# EAGLE design LT ABID SCR (EAGLE 9.6.2)
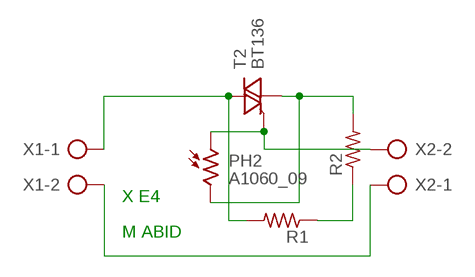
[diagram p0: schematic, sheet 1]

## Parts
PH2  A1060_09  [T0-46-A10XX]
R1  R-US_0204/7  [0204/7]
R2  R-US_0204/7  [0204/7]
T2  BT136  [TO220AB]
X1  AK300/2  [AK300/2]
X2  AK300/2  [AK300/2]

## Nets
N$1: PH2.2 R2.2 T2.1(A1)
N$3: R1.1 R2.1
N$4: PH2.1 T2.3(G) X2.2
N$5: R1.2 T2.2(A2) X1.1
N$7: X1.2 X2.1

## Notes on the sheet
- X E4
- M ABID

## Library data of the parts
PH2 = ldr:A10: Sensor Robust Light Sensing Applications Outdoor Light Sensing Application Source: http://optoelectronics.perkinelmer.com/content/Datasheets/DTS_PhotocellsA1050.pdf
R1 R2 = R1:R-US_: RESISTOR, American symbol; SPICEPREFIX: R
T2 = triac:BT136: Triac BT136 series E sensitive gate Source: http://www.nxp.com/acrobat_download/datasheets/BT136_SERIES_E_2.pdf
X1 X2 = con-ptr500:AK300/2: CONNECTOR; OC_FARNELL: unknown; OC_NEWARK: unknown

## Board
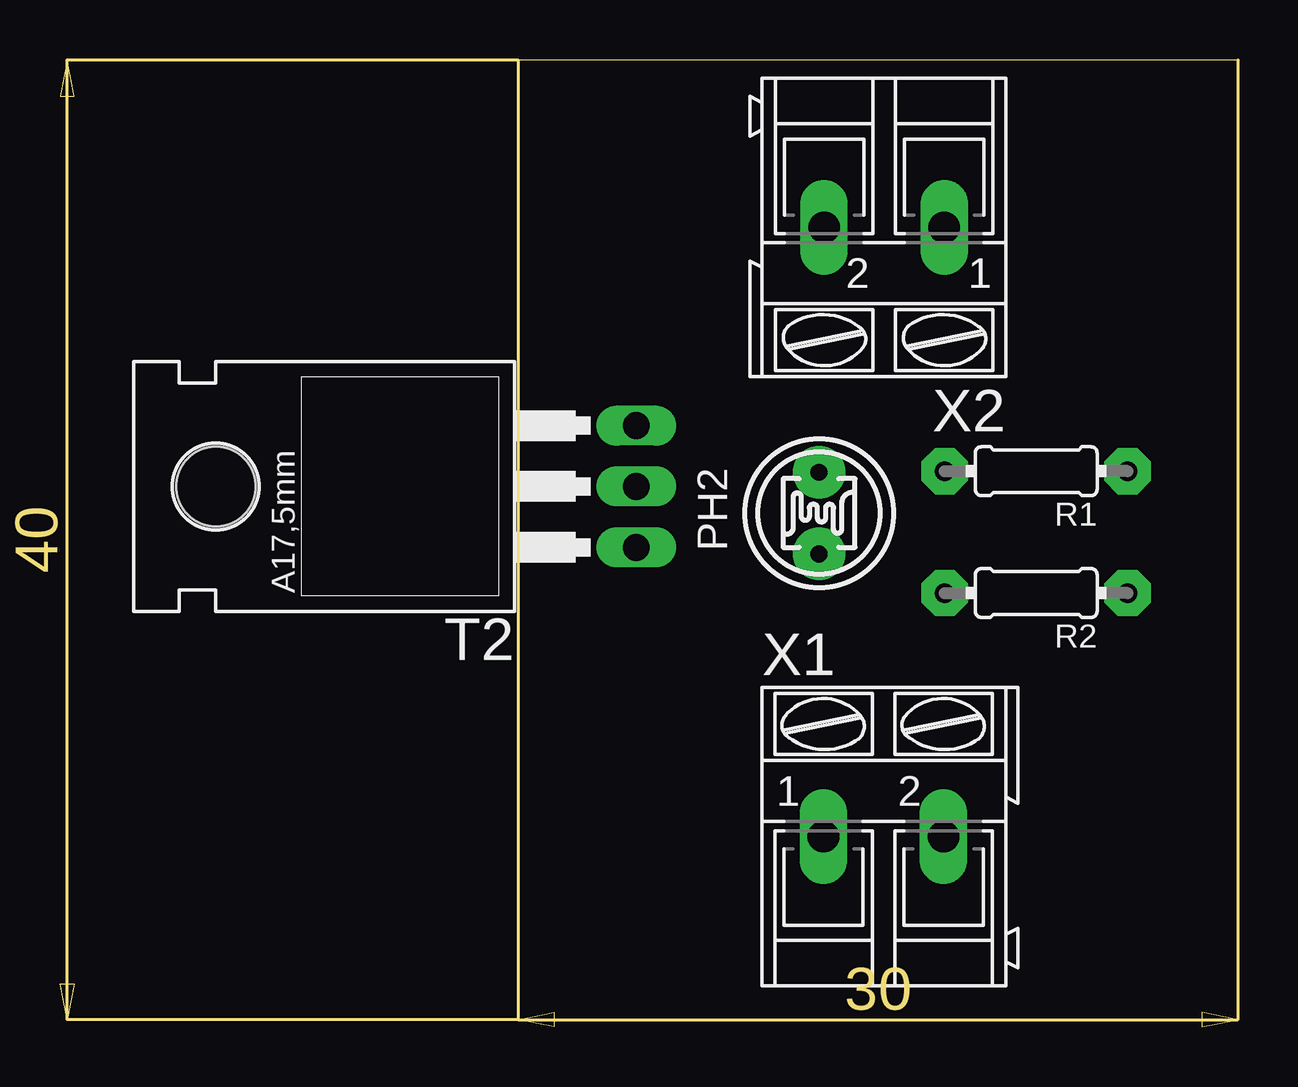
[diagram p1: board, top side]
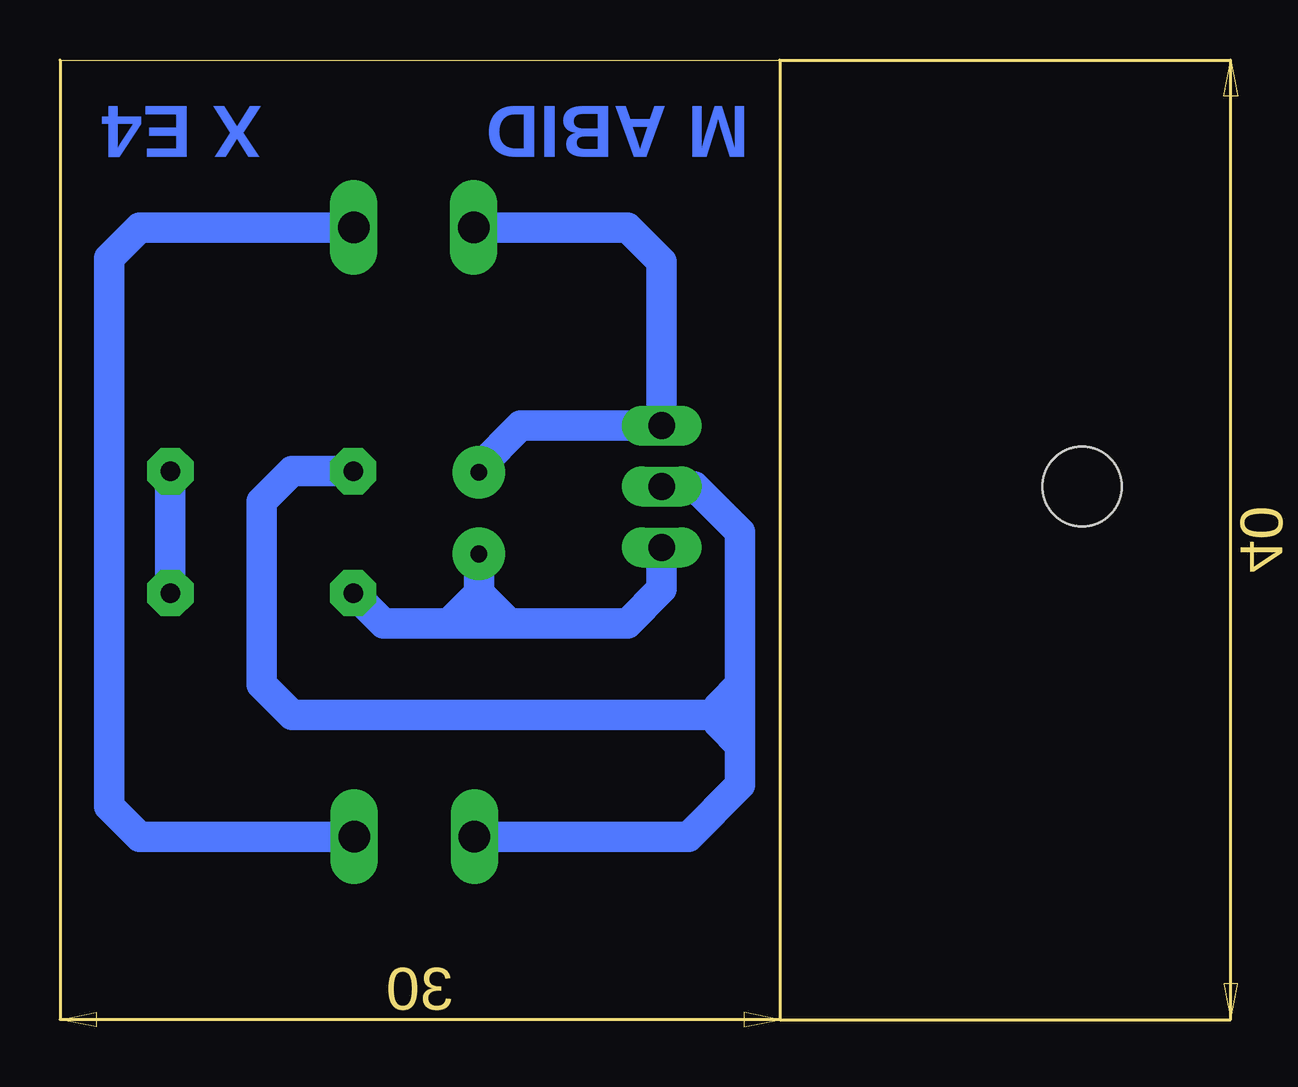
[diagram p2: board, bottom side, seen from below]

Size 30 x 40 mm. Coordinates in mm from the lower left corner, seen from the top.
Outline: 0,0 30,0 30,40 0,40 0,0
Copper layers (1*16): Top 0.035mm / dielectric 1.5mm / Bottom 0.035mm
Design rules "default": minimum track width 6mil, minimum drill 0.35mm, track to track 6mil, track to pad 6mil, pad to pad 6mil, via to via 6mil, smd to smd 6mil, copper to edge 40mil, drill to drill 6mil, minimum pad ring 10mil, minimum via ring 8mil, stop-mask expansion 4mil, vias tented up to drill 0mil, thermal gap 10mil

### Footprints (pad centres in the part's own frame; a part is rotated, then mirrored left to right if it is on the bottom)
T0-46-A10XX = drill 0.7 pad 2.184: 1 -1.7,0; 2 1.7,0
0204/7 = drill 0.813 pad 1.93 octagon: 1 -3.81,0; 2 3.81,0
TO220AB = drill 1.118 long: 1 -2.54,-6.35; 2 0,-6.35; 3 2.54,-6.35 | hole 3.302: 0,11.176
AK300/2 = drill 1.321 long: 1 -2.515,0; 2 2.489,0

### Placement (x,y rotation side)
PH2  12.54,21.11 270 top
R1  21.59,22.86 180 top
R2  21.59,17.78 180 top
T2  -1.43,22.22 90 top
X1  15.24,7.62 0 top
X2  15.24,33.02 180 top

### Tracks (layer width: path | path; a pad name or v marks a point on that pad's centre or on a via)
N$1
  Bottom 1.27: 12.7,19.25 PH2.2 12.54,17.78 | R2.2 16.51,16.51 13.97,16.51 13.81,16.51 | 13.81,16.51 12.7,16.51 | 12.7,16.51 11.43,16.51 | 11.43,16.51 6.35,16.51 4.92,17.94 T2.1 | 12.7,16.51 12.54,16.67 12.54,17.78 | 12.54,17.78 11.43,16.67 11.43,16.51 | 12.54,17.78 13.81,16.51
N$3
  Bottom 1.27: R1.1 R2.1
N$4
  Bottom 1.27: X2.2 12.7,33.02 | 12.7,33.02 6.35,33.02 4.92,31.59 T2.3 10.8,24.76 12.54,23.02 PH2.1 | 12.54,32.86 12.7,33.02
N$5
  Bottom 1.27: 1.65,13.97 1.65,20.32 3.55,22.22 T2.2 | 1.65,13.97 1.65,12.7 | 1.65,12.7 1.65,11.43 | 1.65,11.43 1.65,9.78 3.81,7.62 X1.1 12.7,7.64 | R1.2 20.32,22.86 21.59,21.59 21.59,13.97 20.32,12.7 2.54,12.7 | 1.65,12.7 2.54,12.7 | 1.65,13.97 2.54,13.08 2.54,12.7 | 2.54,12.7 2.54,12.32 1.65,11.43
N$7
  Bottom 1.27: X2.1 26.67,33.02 27.94,31.75 27.94,8.89 26.67,7.62 X1.2

### Text on the board
Bottom: M ABID | X E4